# EAGLE design hvreg_feedback_3PS_ACDC_parallel (EAGLE 7.2.0)
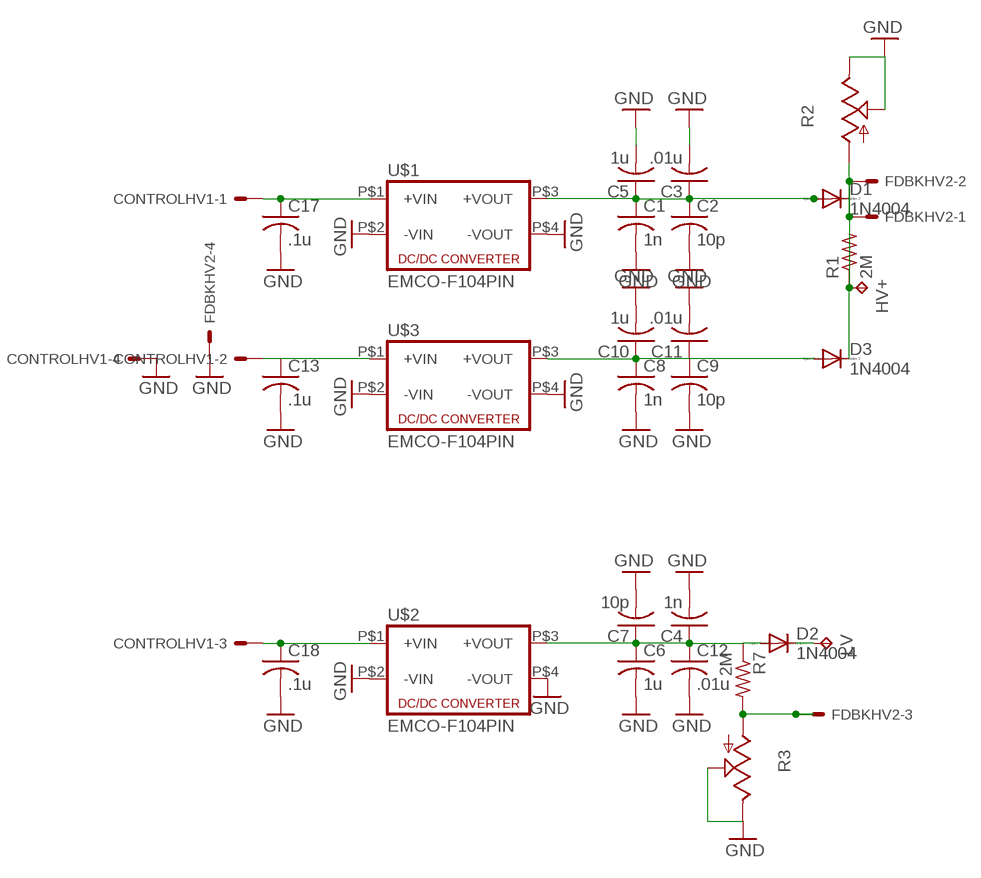
[diagram p0: schematic, sheet 1]

## Parts
C1  1n  C-US102-043X133  [C102-043X133]
C2  10p  C-US102-043X133  [C102-043X133]
C3  .01u  C-US102-043X133  [C102-043X133]
C4  1n  C-US102-043X133  [C102-043X133]
C5  1u  C-US275-205X316  [C275-205X316]
C6  1u  C-US275-205X316  [C275-205X316]
C7  10p  C-US102-043X133  [C102-043X133]
C8  1n  C-US102-043X133  [C102-043X133]
C9  10p  C-US102-043X133  [C102-043X133]
C10  1u  C-US275-205X316  [C275-205X316]
C11  .01u  C-US102-043X133  [C102-043X133]
C12  .01u  C-US102-043X133  [C102-043X133]
C13  .1u  C-US102-043X133  [C102-043X133]
C17  .1u  C-US102-043X133  [C102-043X133]
C18  .1u  C-US102-043X133  [C102-043X133]
CONTROLHV1  KK-156-4  [KK-156-4]
D1  1N4004  [DO41-10]
D2  1N4004  [DO41-10]
D3  1N4004  [DO41-10]
FDBKHV2  KK-156-4  [KK-156-4]
HV+  TPPAD1-20Y  [P1-20Y]
LV  TPPAD1-20Y  [P1-20Y]
R1  2M  R-US_0613/15  [P0613/15]
R2  TRIM_US-B90P  [SP19L]
R3  TRIM_US-B90P  [SP19L]
R7  2M  R-US_0613/15  [P0613/15]
U$1  EMCO-F104PIN  [EMCO-F]
U$2  EMCO-F104PIN  [EMCO-F]
U$3  EMCO-F104PIN  [EMCO-F]

## Nets
GND: C1.2 C2.2 C3.2 C4.2 C5.2 C6.2 C7.2 C8.2 C9.2 C10.2 C11.2 C12.2 C13.2 C17.2 C18.2 CONTROLHV1.4 FDBKHV2.4 R2.E R2.S R3.E R3.S U$1.P$2(-VIN) U$1.P$4(-VOUT) U$2.P$2(-VIN) U$2.P$4(-VOUT) U$3.P$2(-VIN) U$3.P$4(-VOUT)
N$1: C1.1 C2.1 C3.1 C5.1 D1.A U$1.P$3(+VOUT)
N$2: C4.1 C6.1 C7.1 C12.1 D2.A R7.1 U$2.P$3(+VOUT)
N$3: FDBKHV2.1 FDBKHV2.2 R1.2 R2.A
N$4: D2.C LV.TP
N$6: D1.C D3.C HV+.TP R1.1
N$7: C8.1 C9.1 C10.1 C11.1 D3.A U$3.P$3(+VOUT)
N$8: FDBKHV2.3 R3.A R7.2
N$10: C13.1 CONTROLHV1.2 U$3.P$1(+VIN)
N$13: C17.1 CONTROLHV1.1 U$1.P$1(+VIN)
N$15: C18.1 CONTROLHV1.3 U$2.P$1(+VIN)

## Library data of the parts
C1-C13 C17 C18 = rcl:C-US: CAPACITOR, American symbol
CONTROLHV1 FDBKHV2 = con-molex:KK-156-4: KK 156 HEADER Source: http://www.molex.com/pdm_docs/sd/026604100_sd.pdf; OC_FARNELL: unknown; OC_NEWARK: unknown
D1-D3 = diode:1N4004: DIODE general purpose rectifier, 1 A
HV+ LV = testpad:TP: Test pad
R1 R7 = resistor:R-US_: RESISTOR, American symbol
R2 R3 = pot:TRIM_US-: POTENTIOMETER
U$1-U$3 = dc-dc-converter:EMCO-F10

## Board
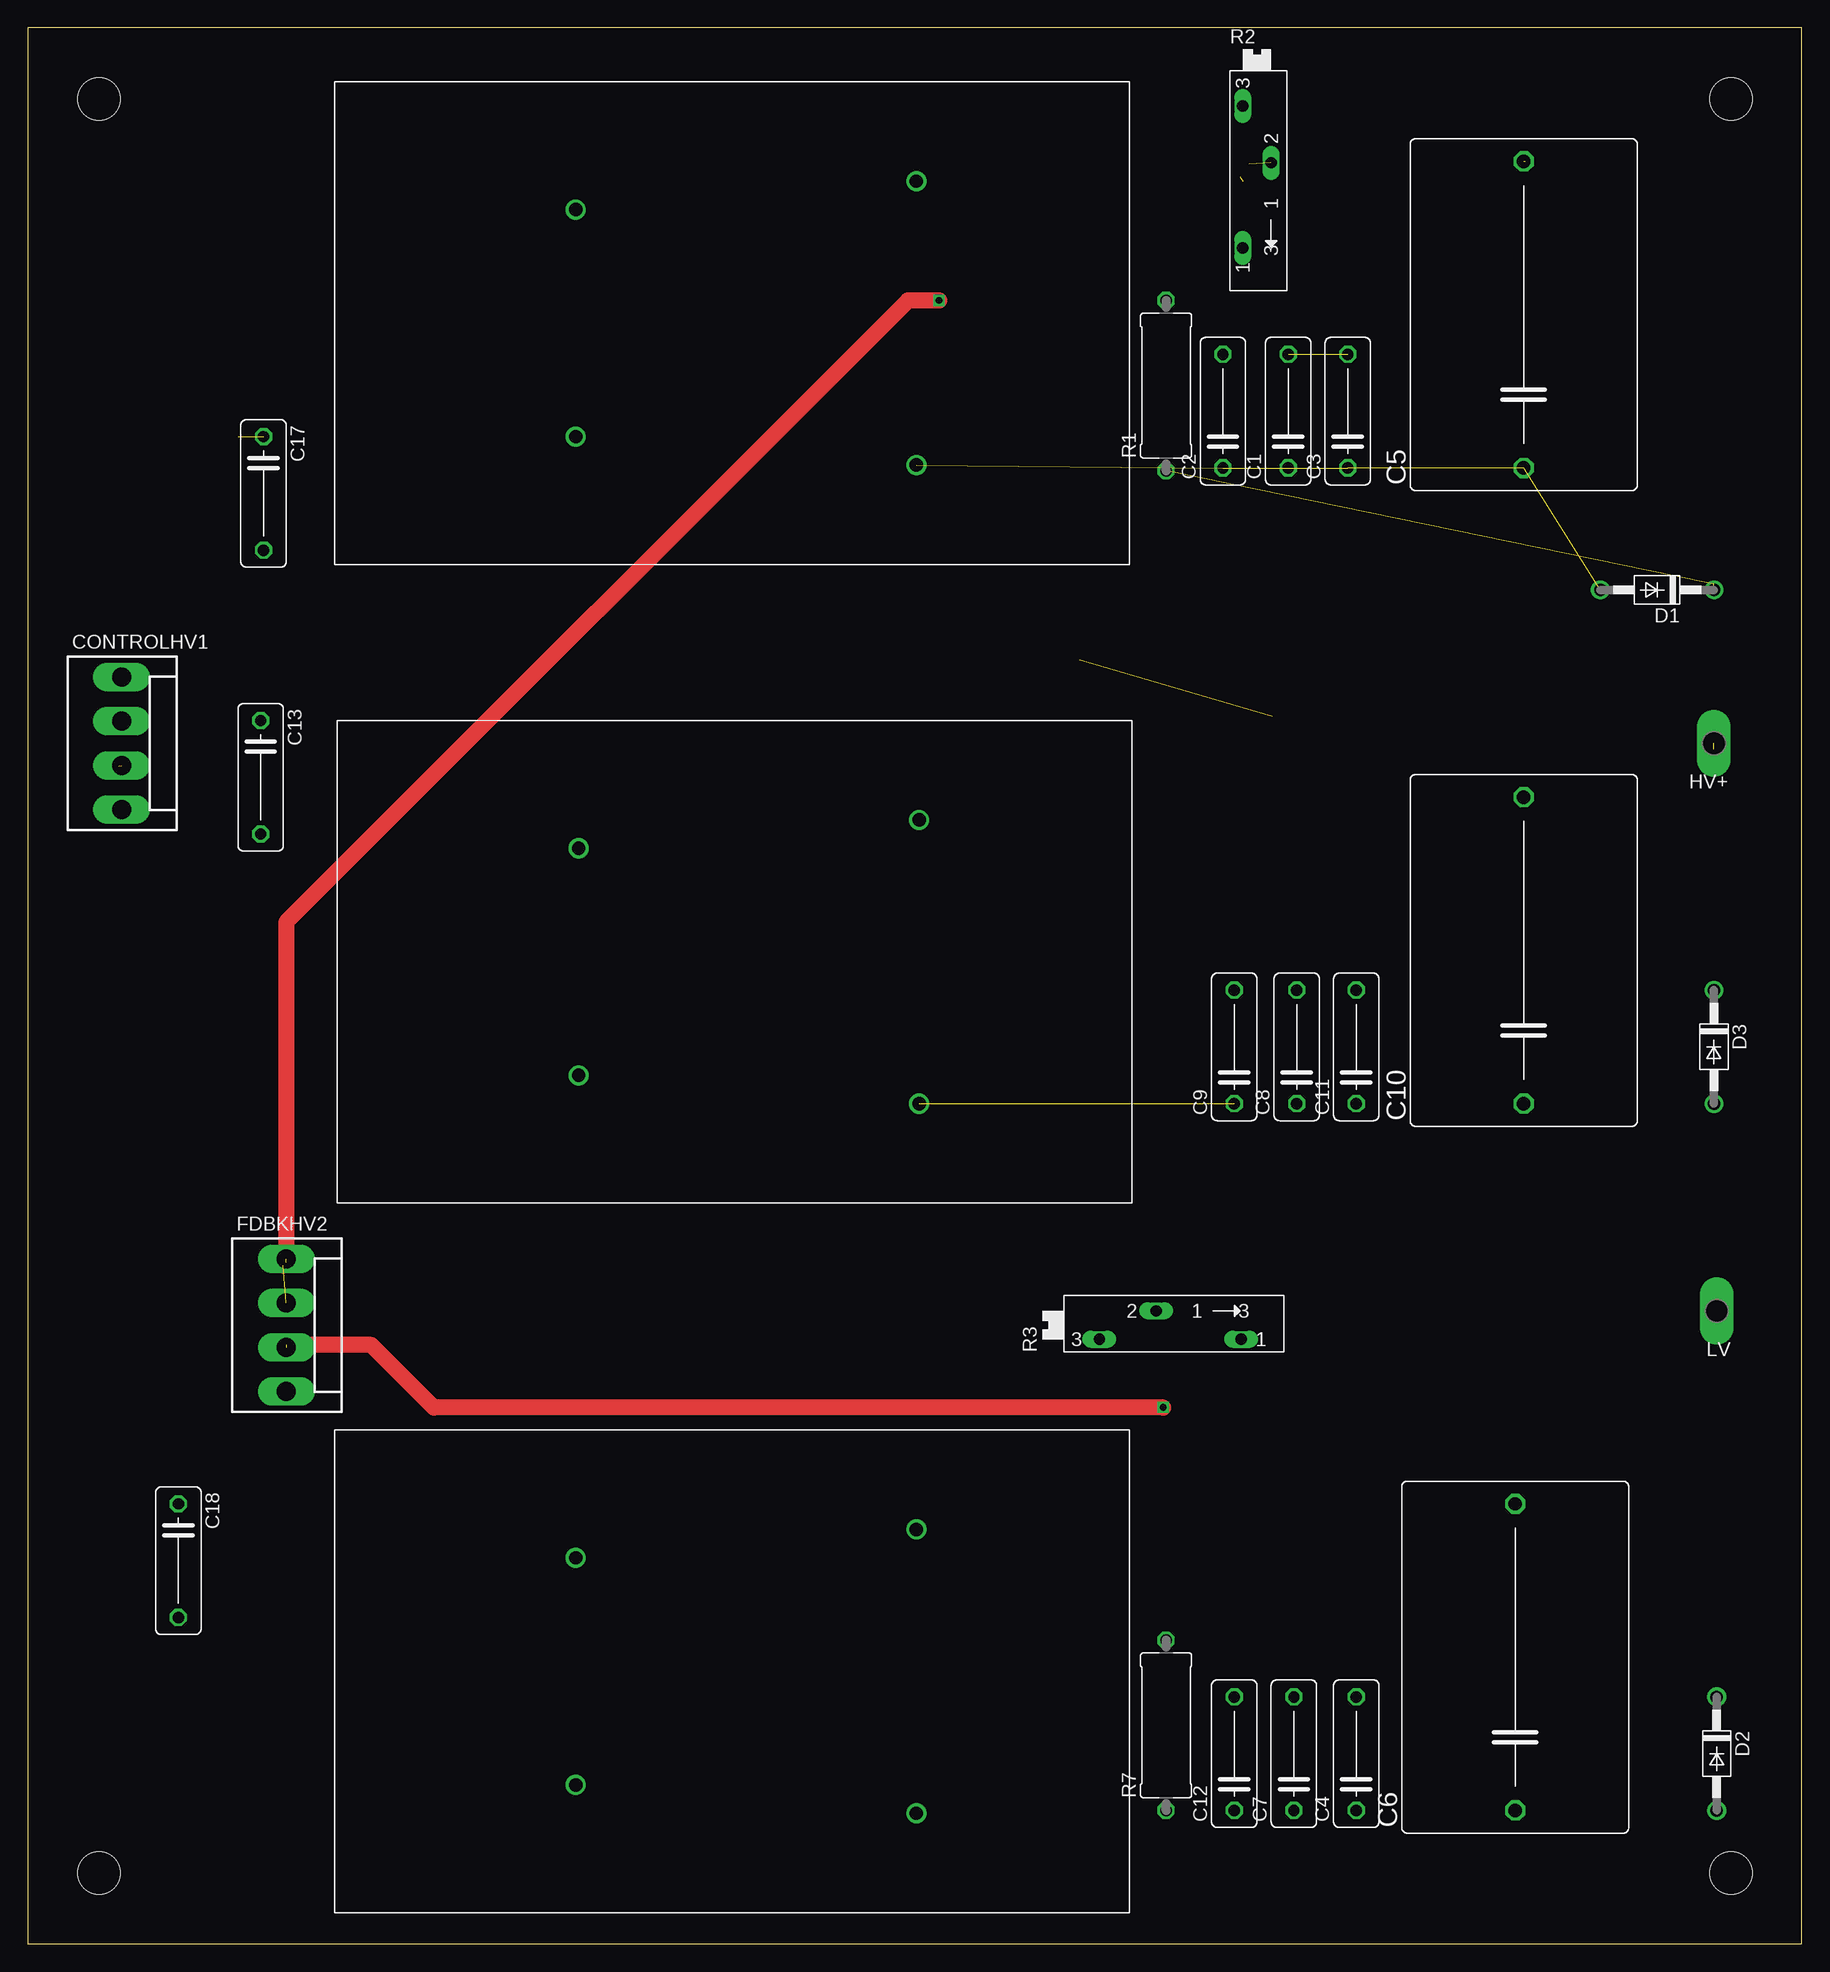
[diagram p1: board, top side]
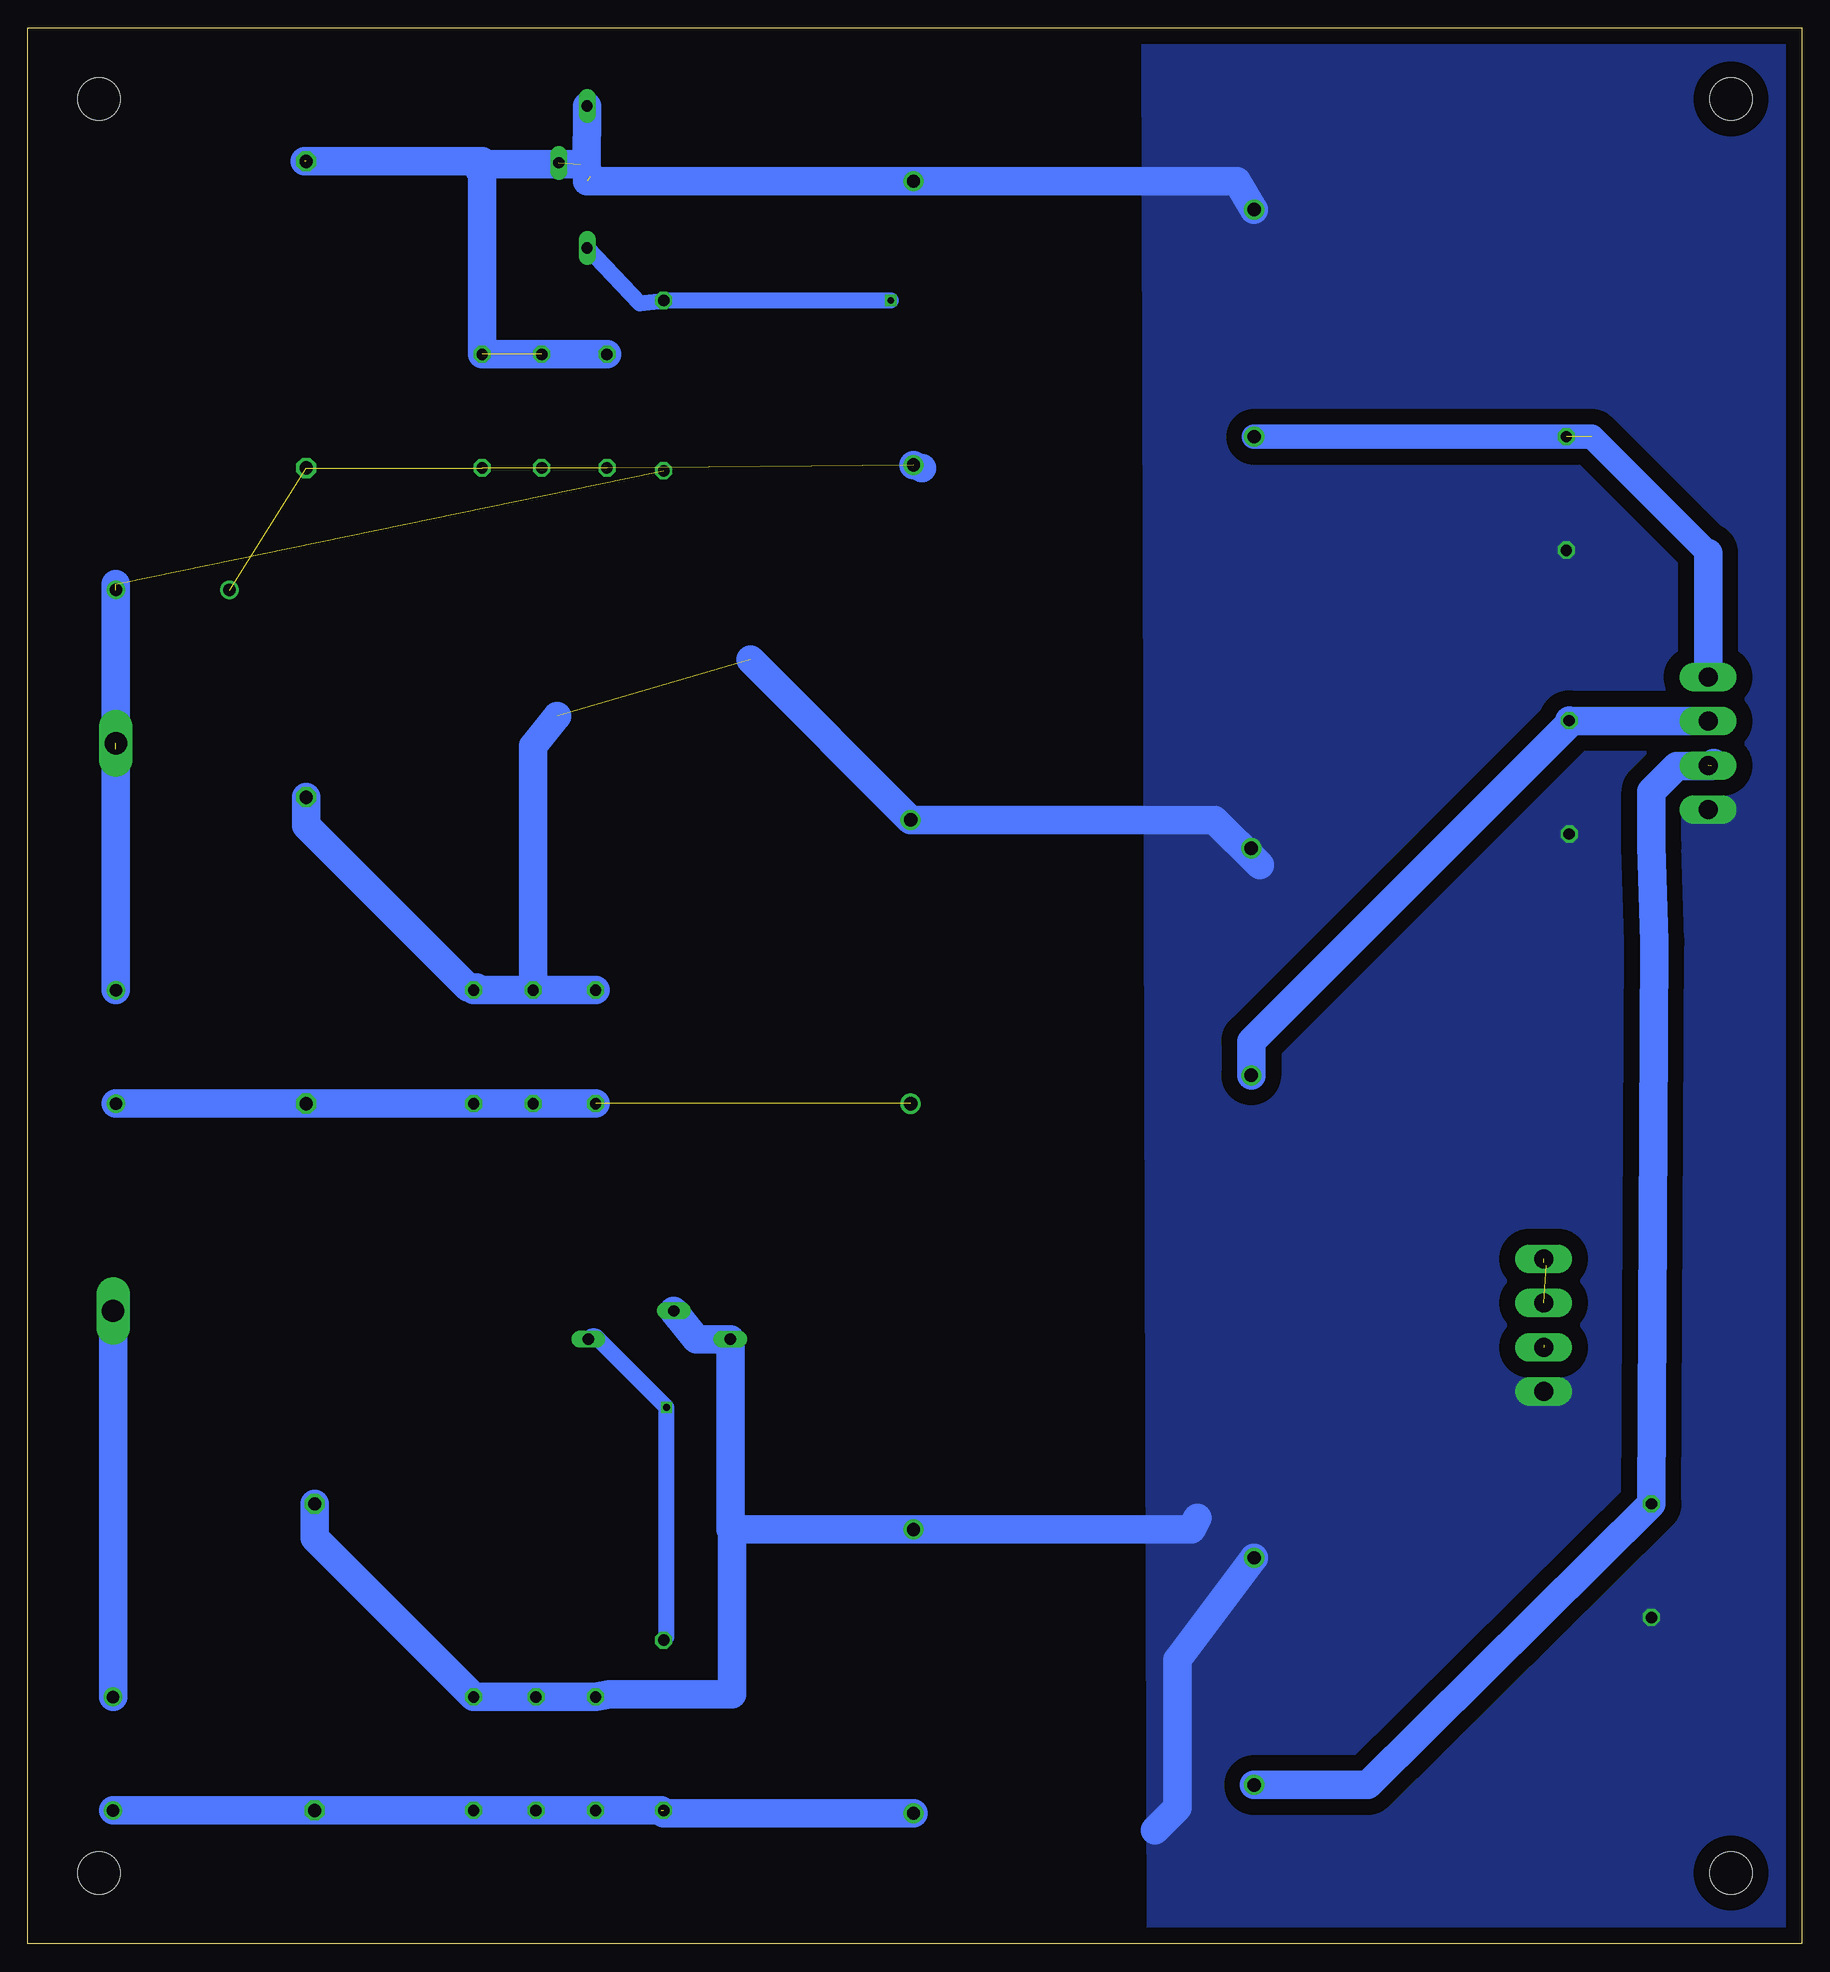
[diagram p2: board, bottom side, seen from below]

Size 158.75 x 171.45 mm. Coordinates in mm from the lower left corner, seen from the top.
Outline: 0,0 158.75,0 158.75,171.45 0,171.45 0,0
Copper layers (1*16): Top 0.035mm / dielectric 1.5mm / Bottom 0.035mm
Design rules "default": minimum track width 10mil, minimum drill 24mil, track to track 8mil, track to pad 8mil, pad to pad 8mil, via to via 8mil, smd to smd 8mil, copper to edge 40mil, drill to drill 8mil, minimum pad ring 10mil, minimum via ring 8mil, stop-mask expansion 4mil, vias tented up to drill 0mil, thermal gap 10mil
Holes 3.8 mm at 152.4,6.35 152.4,165.1 6.35,6.35 6.35,165.1

### Footprints (pad centres in the part's own frame; a part is rotated, then mirrored left to right if it is on the bottom)
C102-043X133 = drill 1.016 octagon: 1 -5.08,0; 2 5.08,0
C275-205X316 = drill 1.194 octagon: 1 -13.716,0; 2 13.716,0
KK-156-4 = drill 1.7 pad 2.184 long: 1 -5.94,0; 2 -1.98,0; 3 1.98,0; 4 5.94,0
DO41-10 = drill 1.118: A 5.08,0; C -5.08,0
P1-20Y = drill 2.007 pad 2.54 long: TP 0,0
P0613/15 = drill 1.016 octagon: 1 -7.62,0; 2 7.62,0
SP19L = drill 1.016 long: A 5.715,-1.27; E -6.985,-1.27; S -1.905,1.27
EMCO-F = drill 1.2: P$1 0,0; P$2 0,20.32; P$3 30.48,-2.54; P$4 30.48,22.86

### Placement (x,y rotation side)
C1  112.78,137.16 90 top
C2  106.93,137.16 90 top
C3  118.11,137.16 90 top
C4  118.87,17.02 90 top
C5  133.86,145.8 90 top
C6  133.1,25.65 90 top
C7  113.28,17.02 90 top
C8  113.54,80.26 90 top
C9  107.95,80.26 90 top
C10  133.86,88.9 90 top
C11  118.87,80.26 90 top
C12  107.95,17.02 90 top
C13  20.83,104.39 270 top
C17  21.08,129.79 270 top
C18  13.46,34.29 270 top
CONTROLHV1  8.38,107.44 270 top
D1  145.8,121.16 180 top
D2  151.13,17.02 270 top
D3  150.88,80.26 270 top
FDBKHV2  23.11,55.37 270 top
HV+  150.88,107.44 180 top
LV  151.13,56.64 180 top
R1  101.85,139.45 90 top
R2  109.98,157.48 270 top
R3  102.87,55.37 0 top
R7  101.85,19.56 90 top
U$1  49.02,134.87 0 top
U$2  49.02,14.22 0 top
U$3  49.28,77.72 0 top

### Tracks (layer width: path | path; a pad name or v marks a point on that pad's centre or on a via)
GND  (5 unrouted)
  Bottom 2.54: U$1.P$2 50.55,157.73 U$1.P$4 108.71,157.73 | 118.11,159 C3.2 C2.2 | 133.99,159.51 118.11,159.51 118.11,159.26 | 108.46,158.12 108.76,159.02 | 108.76,159.02 R2.E | 118.11,159.26 118.11,159 | 118.11,159 118.36,158.75 118.36,159 118.11,159.26 | 118.11,159.26 109.28,159.26 108.76,159.02 | 57.91,10.16 55.88,12.19 55.88,25.4 U$2.P$2 | 48.51,96.52 52.58,100.58 U$3.P$4 94.11,114.94 | 54.1,38.1 54.61,37.08 U$2.P$4 95.89,37.08 | 95.89,37.08 R3.E 98.93,54.1 R3.S | 95.89,37.08 95.76,36.83 | 95.76,36.83 95.5,36.83 | 95.76,36.83 95.76,22.35 106.68,22.35 C12.2 C7.2 C4.2 133.1,36.32 C6.2 | 111.38,109.86 113.54,107.19 C8.2 | C9.2 C8.2 | C8.2 118.36,85.34 | 118.36,85.34 C11.2 | C10.2 133.86,100.08 119.38,85.6 118.62,85.6 118.36,85.34
  pour Bottom (isolate 1.422, no thermals): 0,171.45 58.93,171.2 58.42,0.25 0.25,0
N$1  (5 unrouted)
  Bottom 2.54: 78.74,132.08 U$1.P$3
N$2  (1 unrouted)
  Bottom 2.54: U$2.P$3 101.85,11.68 102.11,11.94 C12.1 C7.1 C4.1 C6.1 D2.A
N$3  (via drill 0.6)  (2 unrouted)
  Top 1.422: v81.53,147.07 78.74,147.07 23.11,91.44 23.11,60.96 22.86,60.71
  Bottom 1.422: v81.53,147.07 R1.2 104.01,146.81 R2.A
N$4
  Bottom 2.54: D2.C LV.TP
N$6  (3 unrouted)
  Bottom 2.54: D3.C 150.88,106.93 | HV+.TP 150.88,121.67
N$7  (1 unrouted)
  Bottom 2.54: C9.1 C8.1 C11.1 C10.1 D3.A
N$8  (via drill 0.6)  (1 unrouted)
  Top 1.422: v101.6,48.01 36.32,48.01 30.73,53.59 23.11,53.59 22.61,53.09
  Bottom 1.422: R7.2 101.6,27.43 v101.6,48.01 107.95,54.36 108.33,54.36 R3.A
N$10
  Bottom 2.54: CONTROLHV1.2 20.78,109.42 C13.1 20.83,109.22 49.28,80.77 U$3.P$1
N$13  (1 unrouted)
  Bottom 2.184: 8.38,124.46 18.8,134.87 U$1.P$1
  Bottom 2.54: CONTROLHV1.1 8.38,124.46
N$15  (1 unrouted)
  Bottom 2.54: 7.87,105.66 8.13,105.41 11.18,105.41 13.46,103.12 13.46,98.3 13.21,89.66 C18.1 38.86,14.22 U$2.P$1